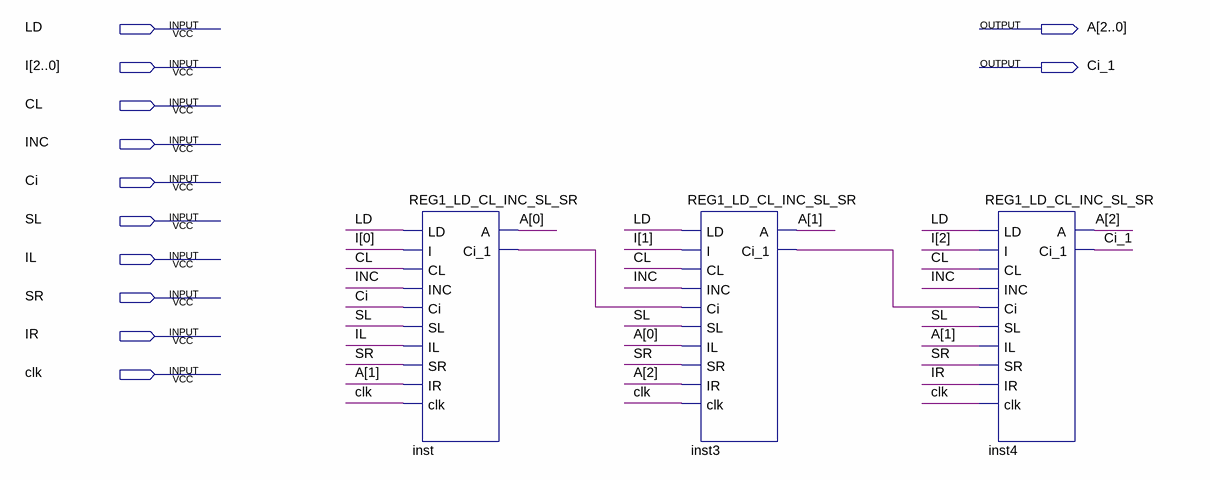
[diagram p0: schematic sheet]
// Quartus schematic REG3_LD_CL_INC_SL_SR.bdf as structural Verilog: 3 symbols, 12 pins
module REG3_LD_CL_INC_SL_SR (
  input  LD,
  input  [2:0] I,
  input  CL,
  input  INC,
  input  Ci,
  input  SL,
  input  IL,
  input  SR,
  input  IR,
  input  clk,
  output [2:0] A,
  output Ci_1
);

  wire inst3_ci_1, inst_ci_1;

  REG1_LD_CL_INC_SL_SR inst (
    .LD(LD), .I(I[0]), .CL(CL), .INC(INC), .Ci(Ci), .SL(SL), .IL(IL), .SR(SR), .IR(A[1]), .clk(clk),
    .A(A[0]), .Ci_1(inst_ci_1));
  REG1_LD_CL_INC_SL_SR inst3 (
    .LD(LD), .I(I[1]), .CL(CL), .INC(INC), .Ci(inst_ci_1), .SL(SL), .IL(A[0]), .SR(SR), .IR(A[2]), .clk(clk),
    .A(A[1]), .Ci_1(inst3_ci_1));
  REG1_LD_CL_INC_SL_SR inst4 (
    .LD(LD), .I(I[2]), .CL(CL), .INC(INC), .Ci(inst3_ci_1), .SL(SL), .IL(A[1]), .SR(SR), .IR(IR), .clk(clk),
    .A(A[2]), .Ci_1(Ci_1));
endmodule
